# Altium schematic sheet ChargeurCondensateurs_old.SchDoc: Chargeur de condensateurs LT3750
size A4; DocumentNumber: 5; Revision: Philippe L.; SheetNumber: 5; SheetTotal: 7; Version: Beta 1.0; Conceptor: William Gendron, Philippe Turgeon
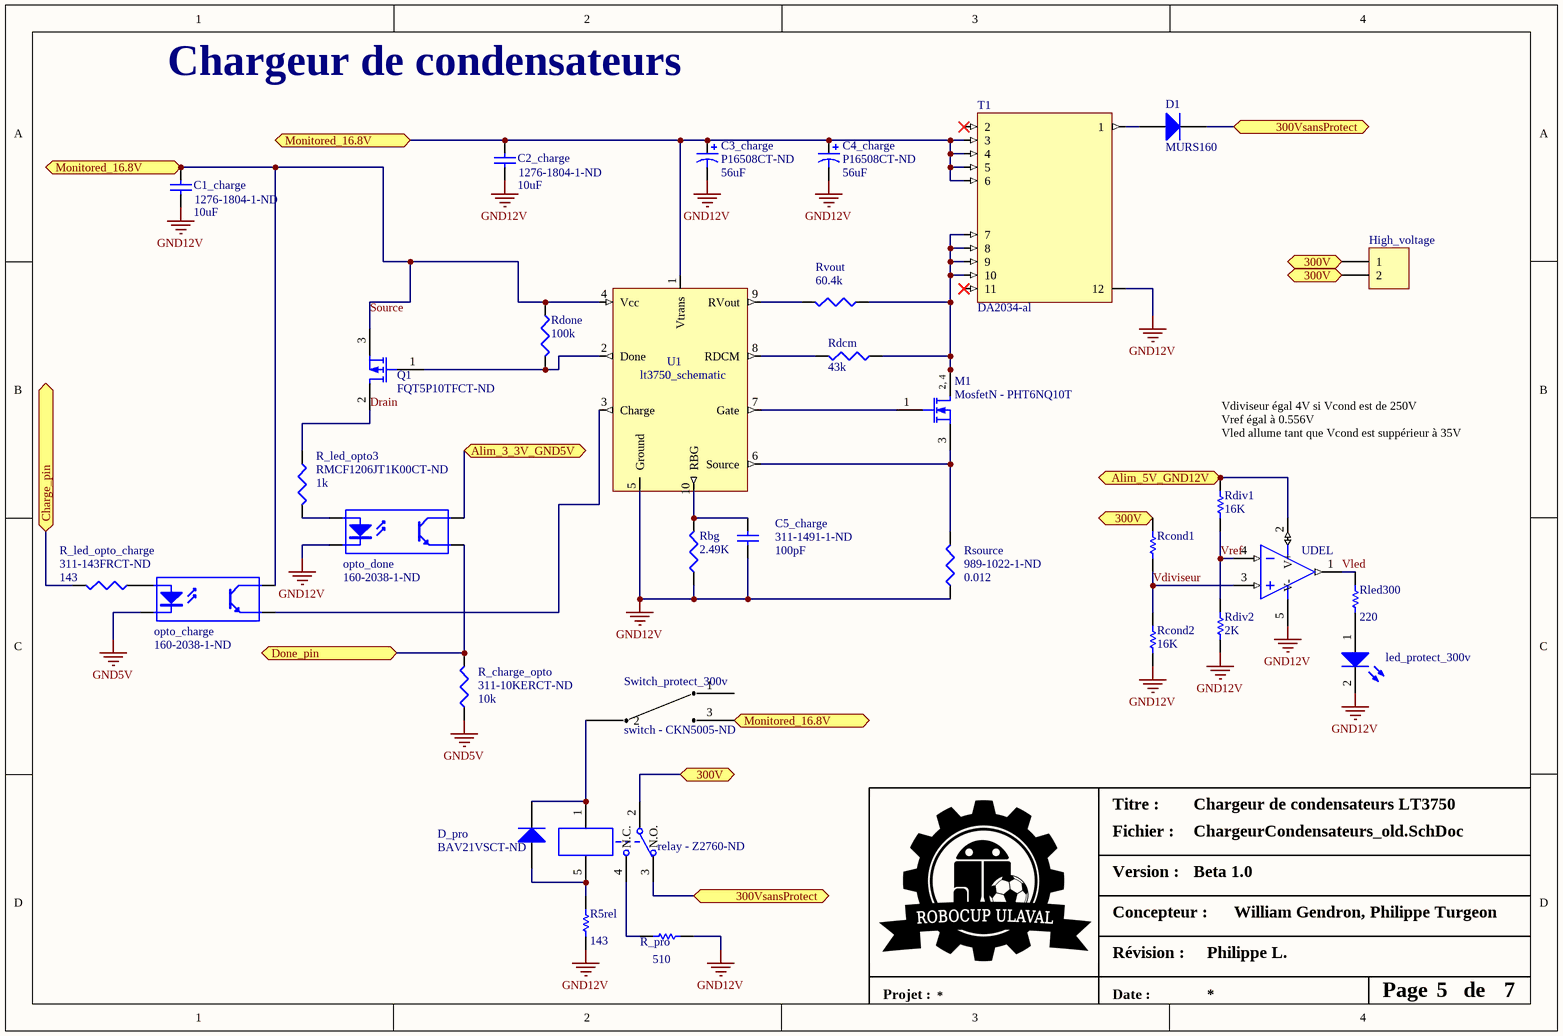
[diagram p0: ChargeurCondensateurs_old.SchDoc]

## Parts
C1_charge  value 10uF  Supplier Part Number 1: 1276-1804-1-ND  [C1206]  (hidden comment: 10uf - 1276-1804-1-ND)
C2_charge  value 10uF  Supplier Part Number 1: 1276-1804-1-ND  [C1206]  (hidden comment: 10uf - 1276-1804-1-ND)
C3_charge  value 56uF  Supplier Part Number 1: P16508CT-ND  [SMD_F12]  (hidden comment: 56uf - P16508CT-ND)
C4_charge  value 56uF  Supplier Part Number 1: P16508CT-ND  [SMD_F12]  (hidden comment: 56uf - P16508CT-ND)
C5_charge  value 100pF  Supplier Part Number 1: 311-1491-1-ND  [C1206]  (hidden comment: 100pf - 311-1491-1-ND)
D1  MURS160  [SMB]
D_pro  Supplier Part Number 1: BAV21VSCT-ND  [DO-35]  (hidden comment: Diode - BAV21VSCT-ND)
High_voltage  300V - FWJ-02-01-T-S  [FWJ_series _2pos_bottom]  (value not drawn)
led_protect_300v  led - 754-1142-1-ND  [5mm_led]  (value not drawn)
M1  MosfetN - PHT6NQ10T  [mySOT223]
opto_charge  160-2038-1-ND  [Opto_simple]
opto_done  160-2038-1-ND  [Opto_simple]
Q1  Supplier Part Number 1: FQT5P10TFCT-ND  [SOT223_N]  (hidden comment: MOSFET-P - FQT5P10TFCT-ND)
R5rel  value 143  [c1206]  (hidden comment: Res1)
R_charge_opto  value 10k  Supplier Part Number 1: 311-10KERCT-ND  [C1206]  (hidden comment: Res3)
R_led_opto3  value 1k  Supplier Part Number 1: RMCF1206JT1K00CT-ND  [C1206]  (hidden comment: 1k - RMCF1206JT1K00CT-ND)
R_led_opto_charge  value 143  Supplier Part Number 1: 311-143FRCT-ND  [C1206]  (hidden comment: 143 - 311-143FRCT-ND)
R_pro  value 510  [10Wres_rect]  (hidden comment: 510ohms - 510W-10-ND)
Rbg  value 2.49K  [C1206]  (hidden comment: 2.49k - RMCF1206FT2K49CT-ND)
Rcond1  1Mohms - A116104CT-ND  [2512 (6432 Metric)]  (value not drawn)
Rcond2  value 16K  [c1206]  (hidden comment: 16k - P16KECT-ND)
Rdcm  value 43k  [C1206]  (hidden comment: 43k - RMCF1206JT43K0CT-ND)
Rdiv1  value 16K  [c1206]  (hidden comment: 16k - P16KECT-ND)
Rdiv2  value 2K  [c1206]  (hidden comment: 2k - RMCF1206JT2K00CT-ND)
Rdone  value 100k  [C1206]  (hidden comment: 100k - RMCF1206JT100KCT-ND)
Rled300  value 220  [c1206]  (hidden comment: 220 ohms - 311-220ERDKR-ND)
Rsource  value 0.012  Supplier Part Number 1: 989-1022-1-ND  [C1206]  (hidden comment: 0.012ohm - 989-1022-1-ND)
Rvout  value 60.4k  [C1206]  (hidden comment: 60.4k - RMCF1206FT60K4CT-ND)
Switch_protect_300v  switch - CKN5005-ND  [1101M2S3ABE2]
T1  DA2034-al  [DA2034]
U1  lt3750_schematic  [myMsop10]
UDEL  opamp - MCP6L71RT-E/OTCT-ND  [SOT-23-5]  (value not drawn)
Z6RL  relay - Z2760-ND  [G6RL]

## Ports
300V (bidir), 300VsansProtect (bidir), Alim_3_3V_GND5V (bidir), Alim_5V_GND12V (bidir), Charge_pin (bidir), Done_pin (bidir), Monitored_16.8V (bidir)

## Nets
GND5V: opto_charge.2(K) R_charge_opto.1
GND12V: C1_charge.1 C2_charge.2 C3_charge.2 C4_charge.2 C5_charge.2 led_protect_300v.2(K) opto_done.2(K) R5rel.2 R_pro.1 Rbg.1 Rcond2.1 Rdiv2.1 Rsource.1 T1.12 U1.5(Ground) UDEL.5(V-)
300V: High_voltage.1 High_voltage.2 Rcond1.2 Z6RL.2(Signal_Input) ; port 300V
300VsansProtect: D1.2(K) Z6RL.3(N.O.) ; port 300VsansProtect
Alim_3_3V_GND5V: opto_done.4(C) ; port Alim_3_3V_GND5V
Alim_5V_GND12V: Rdiv1.2 UDEL.2(V+) ; port Alim_5V_GND12V
Charge_pin: R_led_opto_charge.2 ; port Charge_pin
Done_pin: opto_done.3(E) R_charge_opto.2 ; port Done_pin
Drain: Q1.2(D) R_led_opto3.1
Source: C1_charge.2 C2_charge.1 C3_charge.1 C4_charge.1 opto_charge.4(C) Q1.3(S) Rdone.1 Switch_protect_300v.3 T1.3 T1.4 T1.5 T1.6 U1.1(Vtrans) U1.4(Vcc) ; port Monitored_16.8V
Vdiviseur: Rcond1.1 Rcond2.2 UDEL.3(IN+)
Vled: Rled300.2 UDEL.1(OUT)
Vref: Rdiv1.1 Rdiv2.2 UDEL.4(IN-)
NetC5_charge_1: C5_charge.1 Rbg.2 U1.10(RBG)
NetD1_1: D1.1(A) T1.1
NetD_pro_1: D_pro.1(A) R5rel.1 Z6RL.5(Coil_Input_-)
NetD_pro_2: D_pro.2(K) Switch_protect_300v.2 Z6RL.1(Coil_Input_+)
Netled_protect_300v_1: led_protect_300v.1(A) Rled300.1
NetM1_1: M1.1(G) U1.7(Gate)
NetM1_2: M1.2(D) M1.4(D) Rdcm.1 Rvout.1 T1.7 T1.8 T1.9 T1.10
NetM1_3: M1.3(S) Rsource.2 U1.6(Source)
Netopto_charge_1: opto_charge.1(A) R_led_opto_charge.1
Netopto_charge_3: opto_charge.3(E) U1.3(Charge)
Netopto_done_1: opto_done.1(A) R_led_opto3.2
NetQ1_1: Q1.1(G) Rdone.2 U1.2(Done)
NetR_pro_2: R_pro.2 Z6RL.4(N.C.)
NetRdcm_2: Rdcm.2 U1.8(RDCM)
NetRvout_2: Rvout.2 U1.9(RVout)

Not connected (* = marked no-connect by the designer): Switch_protect_300v 1; T1 2* 11*

## Notes on the sheet
- Chargeur de condensateurs
- (near Rdiv1) Vdiviseur égal 4V si Vcond est de 250V
  Vref égal à 0.556V
  Vled allume tant que Vcond est suppérieur à 35V
- Titre :
- Fichier :
- Version :
- Concepteur :
- Révision :
- Projet :
- Date :
- Page
- de
- (in symbol ZVN2110G) 2, 4

## Library data of the parts
C1_charge C2_charge C5_charge = Cap Semi: Capacitor (Semiconductor SIM Model); Supplier 1: Digi-Key
C3_charge C4_charge = Cap Pol3: Polarized Capacitor (Surface Mount); Supplier 1: Digi-Key
D1 = 10BF10: Surface Mountable Ultrafast Recovery Diode; Supplier 1: Digi-Key; Supplier Part Number 1: MURS160-E3/5BTGICT-ND
D_pro = Diode 1N4148: High Conductance Fast Diode; Supplier 1: Digi-Key
High_voltage = Header 2H: Header, 2-Pin, Right Angle; Supplier 1: Samtec; Supplier Part Number 1: FWJ-02-01-T-S
led_protect_300v = LED2: Typical RED, GREEN, YELLOW, AMBER GaAs LED; Supplier 1: Digi-Key; Supplier Part Number 1: 754-1142-1-ND
M1 = ZVN2110G: N-Channel Enhancement Mode Vertical DMOS FET; Supplier 1: Digi-Key; Supplier Part Number 1: 568-6791-1-ND
opto_charge opto_done = Optoisolator1: 4-Pin Phototransistor Optocoupler; Supplier 1: Digi-Key; Supplier Part Number 1: 160-2038-1-ND
Q1 = MOSFET-P: P-Channel MOSFET; Supplier 1: Digi-Key
R5rel R_pro Rcond2 Rdiv1 Rdiv2 Rled300 = Res1: Resistor; Supplier 1: Digi-Key
  R5rel: Supplier Part Number 1: 311-143FRCT-ND
  R_pro: Supplier Part Number 1: 510W-10-ND
  Rcond2: Supplier Part Number 1: P16KECT-ND
  Rdiv1: Published: 8-Jun-2000; LatestRevisionDate: 17-Jul-2002; LatestRevisionNote: Re-released for DXP Platform.; PackageReference: AXIAL-0.3; Publisher: Altium Limited; PackageDescription: Axial Device, Thru-Hole; 2 Leads; 0.3 in Pin Spacing; Supplier Part Number 1: P16KECT-ND
  Rdiv2: Supplier Part Number 1: RMCF1206JT2K00CT-ND
  Rled300: Supplier Part Number 1: 311-220ERDKR-ND
R_charge_opto R_led_opto3 R_led_opto_charge Rbg Rdcm Rdone Rsource Rvout = Res3: Resistor; Supplier 1: Digi-Key
  Rbg: Supplier Part Number 1: RMCF1206FT2K49CT-ND
  Rdcm: Supplier Part Number 1: RMCF1206JT43K0CT-ND
  Rdone: Supplier Part Number 1: RMCF1206JT100KCT-ND
  Rvout: Supplier Part Number 1: RMCF1206FT60K4CT-ND
Rcond1 = Res1: Resistor; Value: 1meg; Supplier Part Number 1: A116104CT-ND; Supplier 1: Digi-Key
Switch_protect_300v = 1101M2S3ABE2: Supplier 1: Digi-Key; Supplier Part Number 1: CKN5005-ND
UDEL = IC OPAMP GP 2MHZ RRO SOT23-5: FET Operational Amplifier; Supplier 1: Digi-Key; Supplier Part Number 1: MCP6L71RT-E/OTCT-ND
Z6RL = Relay-SPDT: Single-Pole Dual-Throw Relay; Supplier 1: Digi-Key; Supplier Part Number 1: Z2760-ND
T1 = DA2034-al: Supplier 1: Coilcraft; Supplier Part Number 1: Da2034-al
U1 = lt3750_schematic: Supplier 1: Digi-Key; Supplier Part Number 1: LT3750EMS#PBF-ND